# Altium schematic sheet main.SchDoc
size A3; Author: onderpolatgumus; SheetNumber: 1; SheetTotal: 1; SPICEModelCacheMHGZOSCT: <root> / <DocumentId>MHGZOSCT</DocumentId> / <CacheFrame Number="0"> / <Model Name="cap" Kind="MDL"> / <Text>*Default semiconductor capacitor / .MODEL CAP C()</Text> / </Model> / </CacheFrame> / </root>
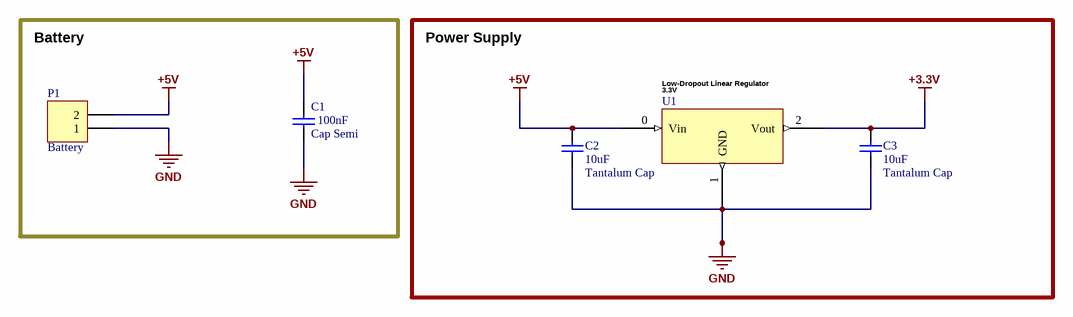
[diagram p0: main.SchDoc]

## Parts
C1  Cap Semi  value 100nF  [C1206]
C2  Tantalum Cap  value 10uF  [C1206]
C3  Tantalum Cap  value 10uF  [C1206]
P1  Battery  [HDR1X2H]
U1  Low-Dropout Linear Regulator  Output Voltage: 3.3V  [4-Pin SOT]

## Blocks framed on the sheet
Battery: C1 P1
Power Supply: C2 C3 U1

## Nets
+3.3V: C3.2 U1.2(Vout)
+5V: C1.2 C2.2 P1.2 U1.0(Vin)
GND: C1.1 C2.1 C3.1 P1.1 U1.1(GND)

## Library data of the parts
C1-C3 = Cap Semi: Capacitor (Semiconductor SIM Model); Published: 8-Jun-2000; LatestRevisionDate: 29-May-2009; LatestRevisionNote: IPC-7351 Footprint Added.; PackageReference: C1206; Publisher: Altium Limited; PackageDescription: Chip Capacitor
P1 = Header 2H: Header, 2-Pin, Right Angle; Voltage: 9V; LatestRevisionDate: 17-Jul-2002; LatestRevisionNote: Re-released for DXP Platform.; Publisher: Altium Limited
U1 = lm1117: The LM1117 is a low dropout voltage regulator with a / dropout of 1.2 V at 800 mA of load current. / The LM1117 is available in an adjustable version, / which can set the output voltage from 1.25 V to 13.8 V / with only two external resistors. In addition, the device / is available in five fixed voltages, 1.8 V, 2.5 V, 3.3 V, / and 5 V. / The LM1117 offers current limiting and thermal / shutdown. The circuit includes a Zener trimmed band / gap reference to assure output voltage accuracy to / within ±1%. / A minimum of 10-µF tantalum capacitor is required / at the output to improve the transient response and / stability.; ComponentLink1Description: Datasheet; ComponentLink1URL: https://www.ti.com/lit/ds/symlink/lm1117.pdf